# EAGLE design circuit (EAGLE 6.6.0)
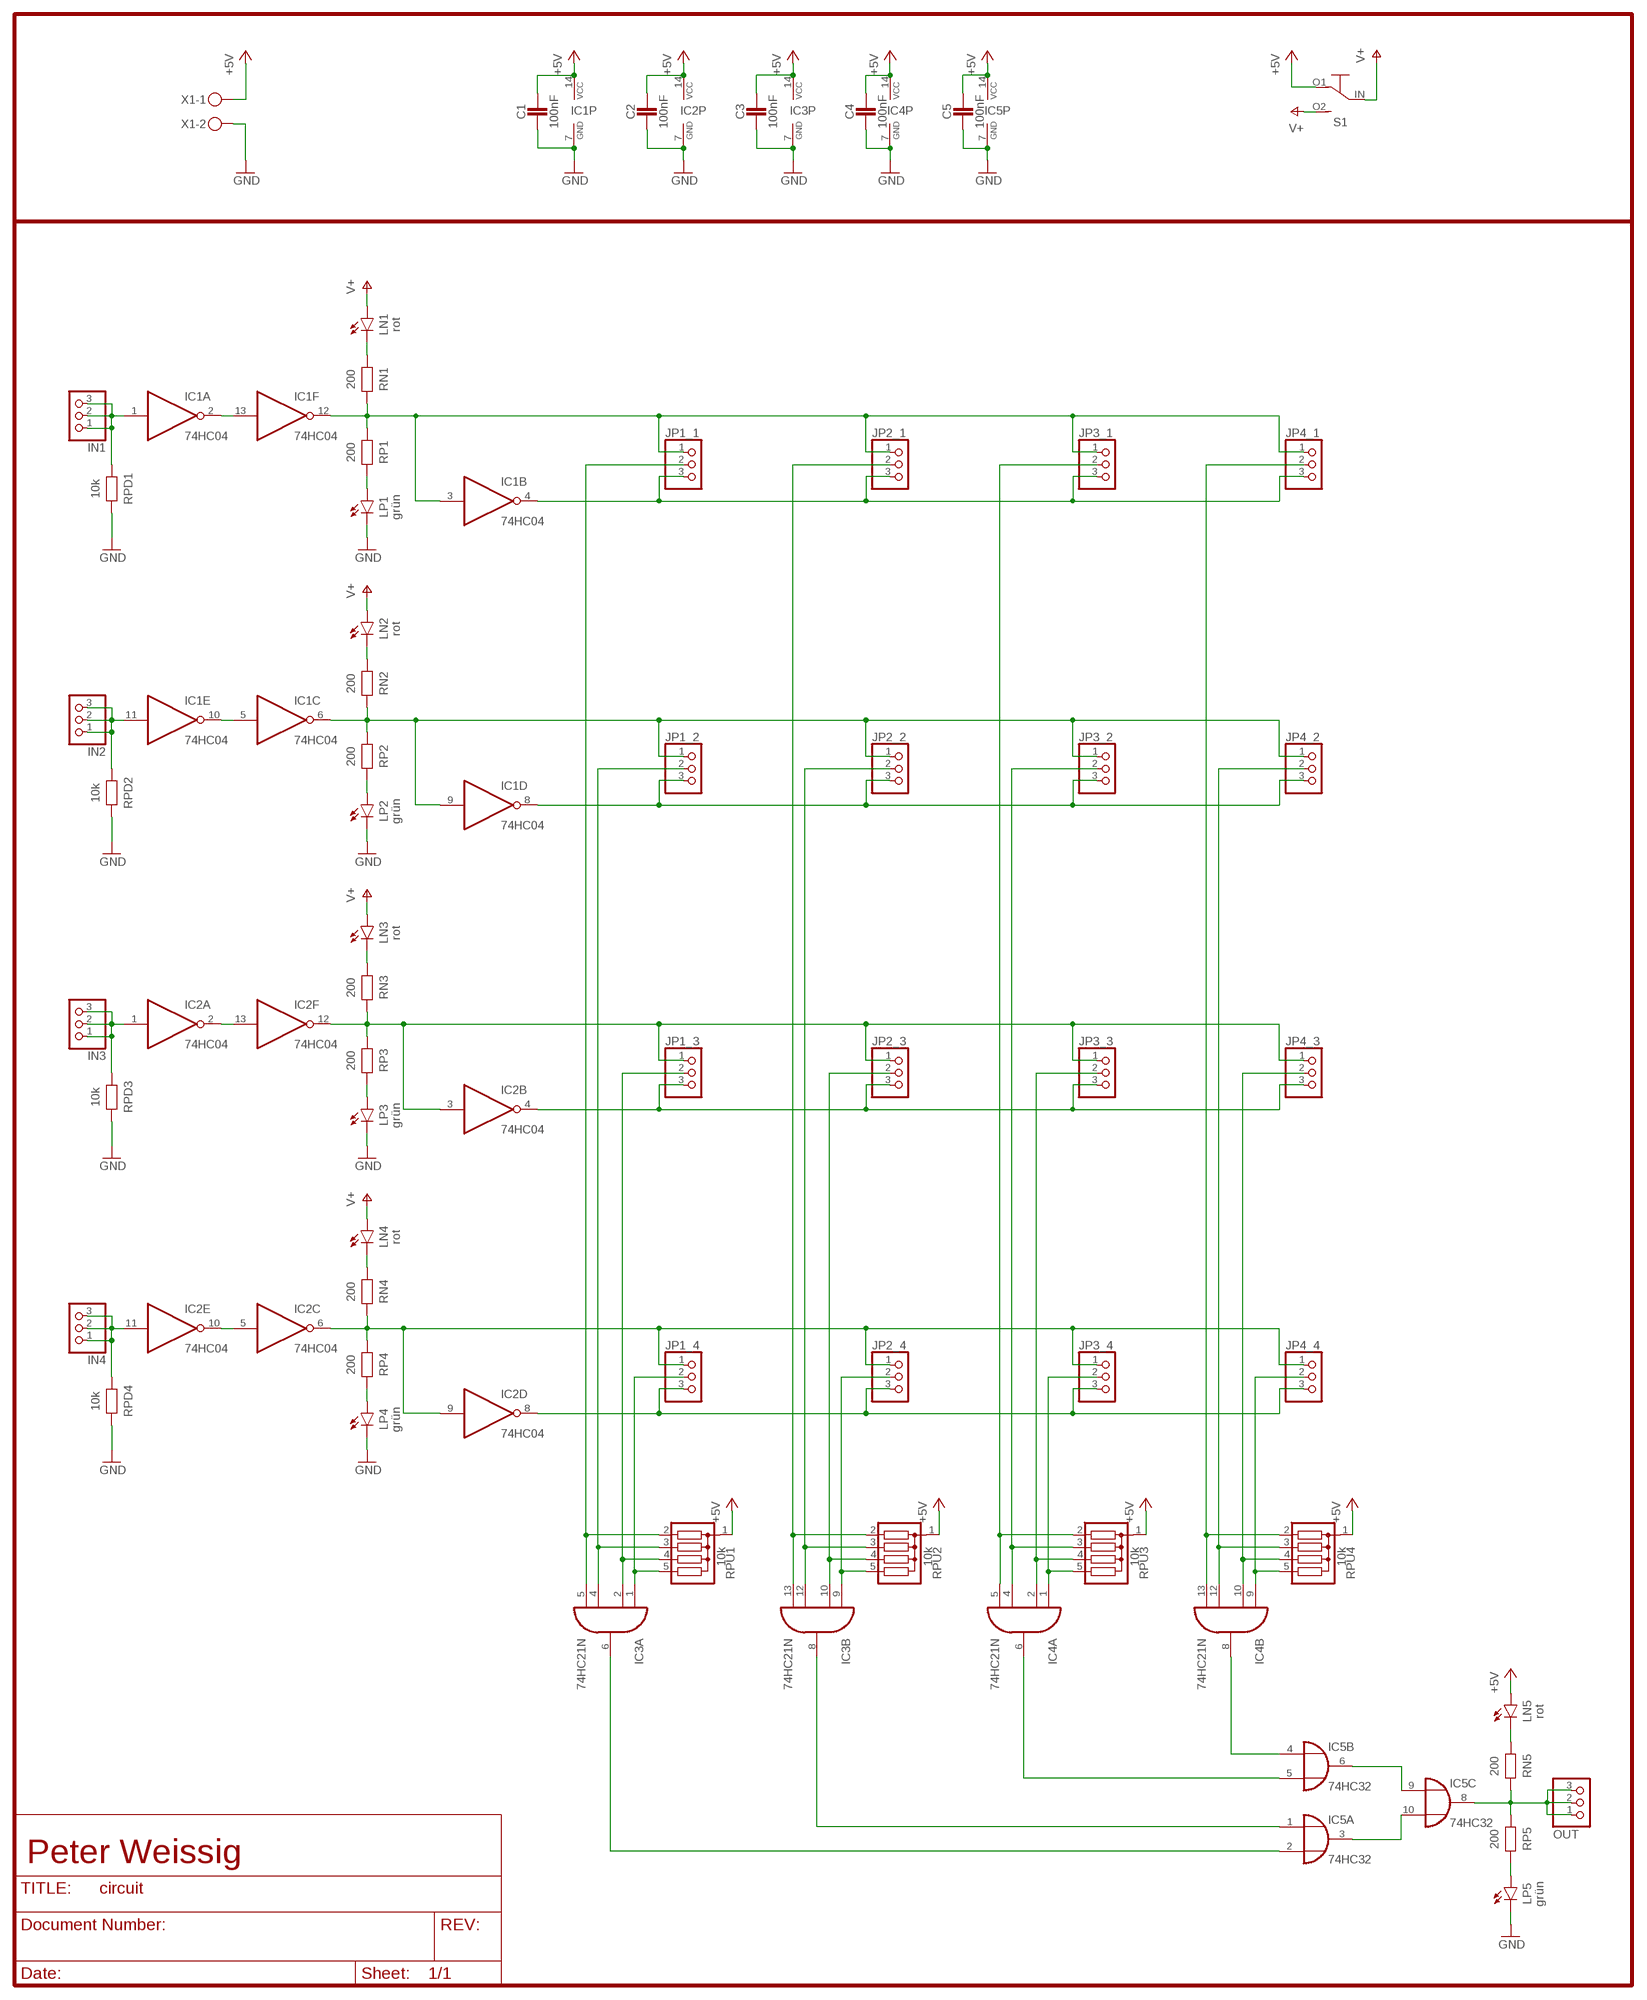
[diagram p0: schematic, sheet 1]

## Parts
C1  100nF  CAPACITATOR-2,5MM  [C_THT_2]
C2  100nF  CAPACITATOR-2,5MM  [C_THT_2]
C3  100nF  CAPACITATOR-5MM  [C_THT_3]
C4  100nF  CAPACITATOR-5MM  [C_THT_3]
C5  100nF  CAPACITATOR-2,5MM  [C_THT_2]
IC1  74HC04  74AC04N  [DIL14]
IC2  74HC04  74AC04N  [DIL14]
IC3  74HC21N  [DIL14]
IC4  74HC21N  [DIL14]
IC5  74HC32  74AC32N  [DIL14]
IN1  PINHD-1X3  [1X03]
IN2  PINHD-1X3  [1X03]
IN3  PINHD-1X3  [1X03]
IN4  PINHD-1X3  [1X03]
JP1_1  PINHD-1X3  [1X03]
JP1_2  PINHD-1X3  [1X03]
JP1_3  PINHD-1X3  [1X03]
JP1_4  PINHD-1X3  [1X03]
JP2_1  PINHD-1X3  [1X03]
JP2_2  PINHD-1X3  [1X03]
JP2_3  PINHD-1X3  [1X03]
JP2_4  PINHD-1X3  [1X03]
JP3_1  PINHD-1X3  [1X03]
JP3_2  PINHD-1X3  [1X03]
JP3_3  PINHD-1X3  [1X03]
JP3_4  PINHD-1X3  [1X03]
JP4_1  PINHD-1X3  [1X03]
JP4_2  PINHD-1X3  [1X03]
JP4_3  PINHD-1X3  [1X03]
JP4_4  PINHD-1X3  [1X03]
LN1  rot  LED-3MM  [LED_3MM]
LN2  rot  LED-3MM  [LED_3MM]
LN3  rot  LED-3MM  [LED_3MM]
LN4  rot  LED-3MM  [LED_3MM]
LN5  rot  LED-3MM  [LED_3MM]
LP1  grün  LED-3MM  [LED_3MM]
LP2  grün  LED-3MM  [LED_3MM]
LP3  grün  LED-3MM  [LED_3MM]
LP4  grün  LED-3MM  [LED_3MM]
LP5  grün  LED-3MM  [LED_3MM]
OUT  PINHD-1X3  [1X03]
RN1  200  RESISTOR-10MM  [R_THT_4]
RN2  200  RESISTOR-10MM  [R_THT_4]
RN3  200  RESISTOR-10MM  [R_THT_4]
RN4  200  RESISTOR-10MM  [R_THT_4]
RN5  200  RESISTOR-10MM  [R_THT_4]
RP1  200  RESISTOR-10MM  [R_THT_4]
RP2  200  RESISTOR-10MM  [R_THT_4]
RP3  200  RESISTOR-10MM  [R_THT_4]
RP4  200  RESISTOR-10MM  [R_THT_4]
RP5  200  RESISTOR-10MM  [R_THT_4]
RPD1  10k  RESISTOR-10MM  [R_THT_4]
RPD2  10k  RESISTOR-10MM  [R_THT_4]
RPD3  10k  RESISTOR-10MM  [R_THT_4]
RPD4  10k  RESISTOR-10MM  [R_THT_4]
RPU1  10k  G04R  [SIL5]
RPU2  10k  G04R  [SIL5]
RPU3  10k  G04R  [SIL5]
RPU4  10k  G04R  [SIL5]
S1  SCHALTER_UM-KIPP  [SCHALTER_KIPP_UM]
X1  STECKER_SPG_2  [STECKER_SPG_2]

## Nets
+5V: C1.1 C2.1 C3.1 C4.1 C5.1 IC1.14(P:VCC) IC2.14(P:VCC) IC3.14(P:VCC) IC4.14(P:VCC) IC5.14(P:VCC) LN5.A RPU1.1 RPU2.1 RPU3.1 RPU4.1 S1.O1 X1.1
GND: C1.2 C2.2 C3.2 C4.2 C5.2 IC1.7(P:GND) IC2.7(P:GND) IC3.7(P:GND) IC4.7(P:GND) IC5.7(P:GND) LP1.K(C) LP2.K(C) LP3.K(C) LP4.K(C) LP5.K(C) RPD1.1 RPD2.1 RPD3.1 RPD4.1 X1.2
N$1: IC3.5(A:I3) JP1_1.2 RPU1.2
N$2: LN1.K(C) RN1.2
N$3: IC3.13(B:I3) JP2_1.2 RPU2.2
N$4: LP2.A RP2.1
N$5: IC3.12(B:I2) JP2_2.2 RPU2.3
N$6: LN2.K(C) RN2.2
N$10: LP1.A RP1.1
N$12: LP3.A RP3.1
N$13: LN3.K(C) RN3.2
N$14: IC3.10(B:I1) JP2_3.2 RPU2.4
N$15: LP4.A RP4.1
N$16: LN4.K(C) RN4.2
N$17: IC1.1(A:I) IN1.1 IN1.2 IN1.3 RPD1.2
N$18: IC1.11(E:I) IN2.1 IN2.2 IN2.3 RPD2.2
N$19: IC3.9(B:I0) JP2_4.2 RPU2.5
N$20: IC4.5(A:I3) JP3_1.2 RPU3.2
N$21: IC4.4(A:I2) JP3_2.2 RPU3.3
N$22: IC2.11(E:I) IN4.1 IN4.2 IN4.3 RPD4.2
N$23: IC4.2(A:I1) JP3_3.2 RPU3.4
N$24: IC4.1(A:I0) JP3_4.2 RPU3.5
N$25: IC1.2(A:O) IC1.13(F:I)
N$26: IC1.5(C:I) IC1.10(E:O)
N$31: IC2.5(C:I) IC2.10(E:O)
N$32: IC2.2(A:O) IC2.13(F:I)
N$33: IC3.4(A:I2) JP1_2.2 RPU1.3
N$34: IC3.2(A:I1) JP1_3.2 RPU1.4
N$35: IC3.1(A:I0) JP1_4.2 RPU1.5
N$36: IC4.13(B:I3) JP4_1.2 RPU4.2
N$37: IC4.12(B:I2) JP4_2.2 RPU4.3
N$38: IC4.10(B:I1) JP4_3.2 RPU4.4
N$39: IC4.9(B:I0) JP4_4.2 RPU4.5
N$40: IC4.8(B:O) IC5.4(B:I0)
N$41: IC4.6(A:O) IC5.5(B:I1)
N$42: IC3.8(B:O) IC5.1(A:I0)
N$43: IC3.6(A:O) IC5.2(A:I1)
N$44: IC5.6(B:O) IC5.9(C:I0)
N$45: IC5.3(A:O) IC5.10(C:I1)
N$46: LP5.A RP5.1
N$47: LN5.K(C) RN5.2
N$50: IC2.1(A:I) IN3.1 IN3.2 IN3.3 RPD3.2
N_1N: IC1.4(B:O) JP1_1.3 JP2_1.3 JP3_1.3 JP4_1.3
N_1P: IC1.3(B:I) IC1.12(F:O) JP1_1.1 JP2_1.1 JP3_1.1 JP4_1.1 RN1.1 RP1.2
N_2N: IC1.8(D:O) JP1_2.3 JP2_2.3 JP3_2.3 JP4_2.3
N_2P: IC1.6(C:O) IC1.9(D:I) JP1_2.1 JP2_2.1 JP3_2.1 JP4_2.1 RN2.1 RP2.2
N_3N: IC2.4(B:O) JP1_3.3 JP2_3.3 JP3_3.3 JP4_3.3
N_3P: IC2.3(B:I) IC2.12(F:O) JP1_3.1 JP2_3.1 JP3_3.1 JP4_3.1 RN3.1 RP3.2
N_4N: IC2.8(D:O) JP1_4.3 JP2_4.3 JP3_4.3 JP4_4.3
N_4P: IC2.6(C:O) IC2.9(D:I) JP1_4.1 JP2_4.1 JP3_4.1 JP4_4.1 RN4.1 RP4.2
N_4P1: IC5.8(C:O) OUT.1 OUT.2 OUT.3 RN5.1 RP5.2
V+: LN1.A LN2.A LN3.A LN4.A S1.IN S1.O2
Unconnected: IC5.11(D:O) IC5.12(D:I0) IC5.13(D:I1)

## Notes on the sheet
- Peter Weissig

## Library data of the parts
C1-C5 = robo_ag:CAPACITATOR: Kondensator
IC1 IC2 = 74xx-eu:74*04: Hex INVERTER
IC3 IC4 = 74xx-eu:74*21: Dual 4-input AND gate
IC5 = 74xx-eu:74*32: Quad 2-input OR gate
IN1-IN4 JP1_1-JP1_4 JP2_1-JP2_4 JP3_1-JP3_4 JP4_1-JP4_4 OUT = pinhead:PINHD-1X3: PIN HEADER
LN1-LN5 LP1-LP5 = robo_ag:LED: Led Reichelt: LA E67B Variante: PLCC4 560-1400mcd 2,2V; 50mA Gelb-Orange SMD Reichelt: LA E67F Variante: PLCC4_REV 560mcd 2,65V; 50mA Orange SMD
RN1-RN5 RP1-RP5 RPD1-RPD4 = robo_ag:RESISTOR: Widerstand Reichelt: METALL x,xx[k]
RPU1-RPU4 = resistor-sil:G04R: SIL RESISTOR; OC_FARNELL: unknown; OC_NEWARK: unknown
S1 = robo_ag:SCHALTER_UM: Umschalter Reichelt: KIPP 1A11 Variante: KIPP Kippschalter mit Lötösen 5A bei 120V Reichelt: SS SMD402 Variante: SMD 24V 0,2A
X1 = robo_ag:STECKER_SPG_2: Anschlussklemme Reichelt:AKL 101-02 Nicht Anreihbar Reichelt:AKL 057-02 Anreihbar

## Board
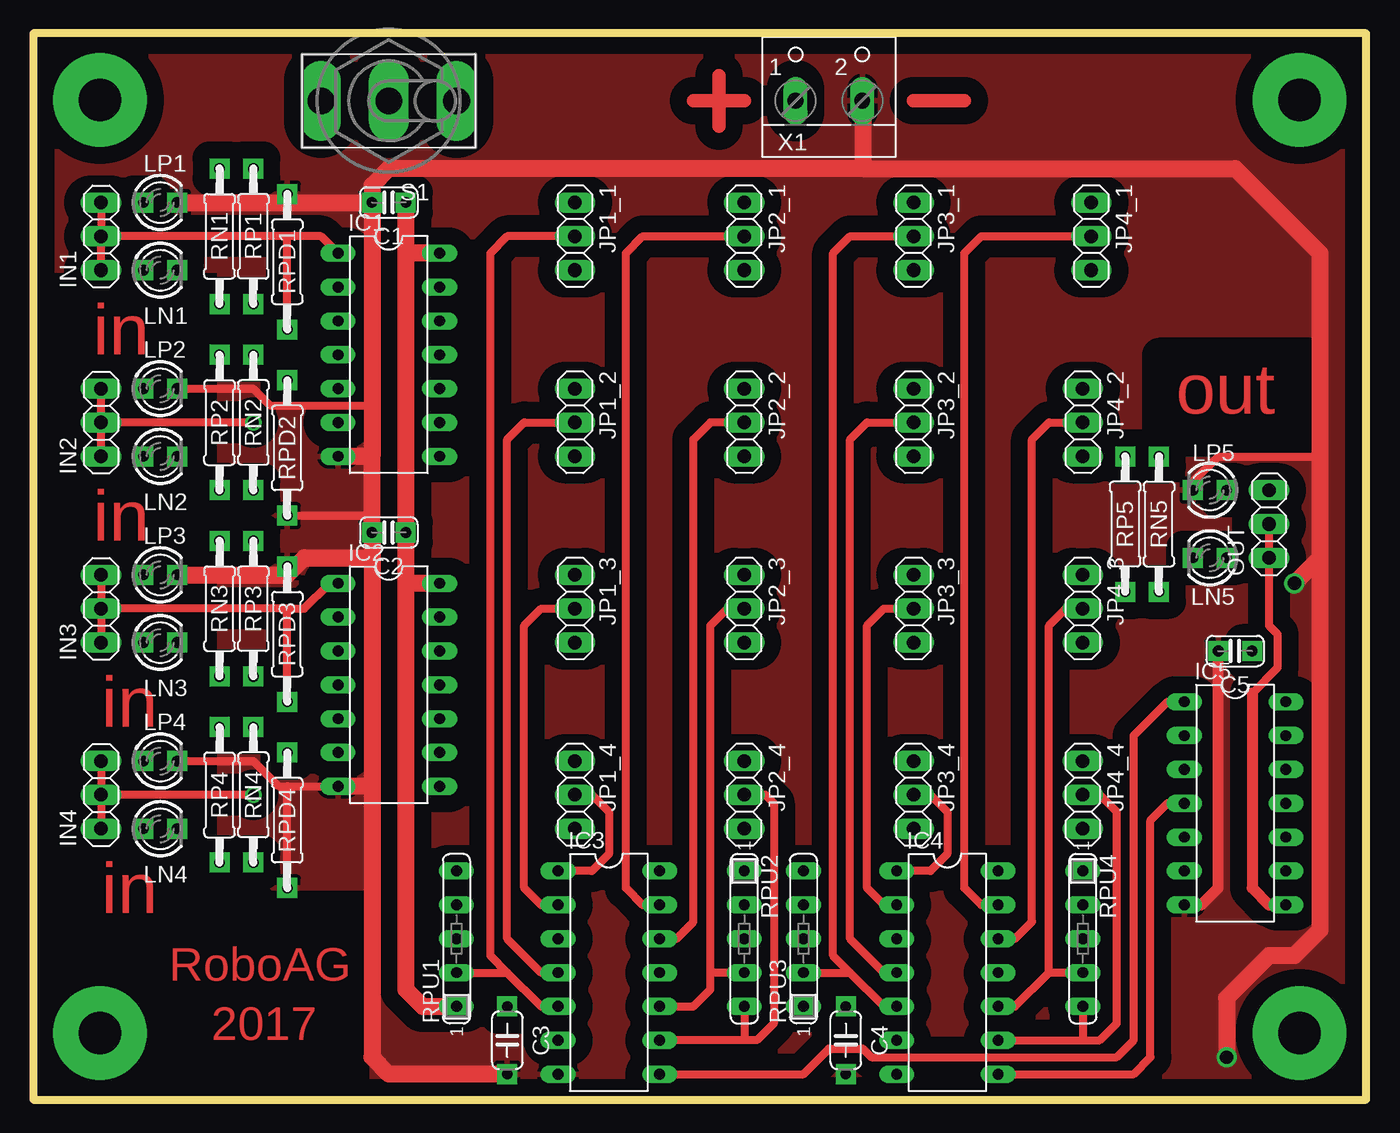
[diagram p1: board, top side]
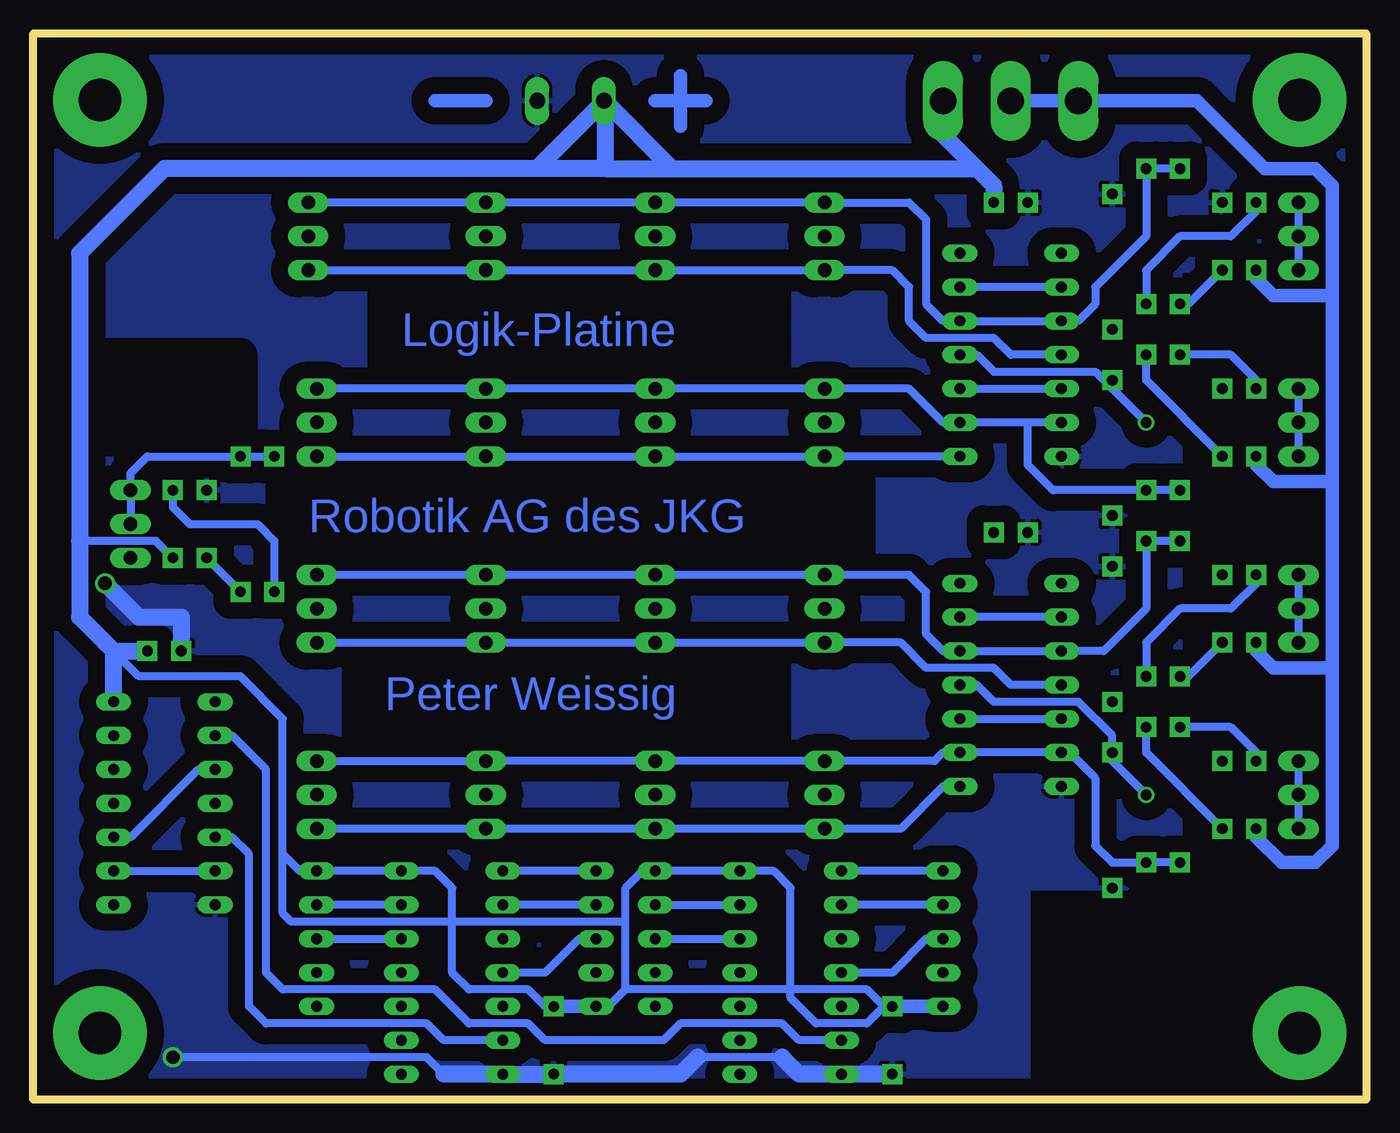
[diagram p2: board, bottom side, seen from below]

Size 100 x 80 mm. Coordinates in mm from the lower left corner, seen from the top.
Outline: 0,0 100,0 100,80 0,80 0,0
Copper layers (1*16): Top 0.035mm / dielectric 1.5mm / Bottom 0.035mm
Design rules "default": minimum track width 10mil, minimum drill 24mil, track to track 8mil, track to pad 8mil, pad to pad 8mil, via to via 8mil, smd to smd 8mil, copper to edge 40mil, drill to drill 8mil, minimum pad ring 10mil, minimum via ring 8mil, stop-mask expansion 4mil, vias tented up to drill 0mil, thermal gap 10mil
tRestrict: area 84.5,49.5 to 95.9,55.9
bRestrict: area 44.5,54.6 to 73.7,61; area 38.1,40.6 to 81.3,47; area 44.5,26.7 to 75.6,33; area 84.5,49.5 to 95.9,55.9

### Footprints (pad centres in the part's own frame; a part is rotated, then mirrored left to right if it is on the bottom)
C_THT_2 = drill 0.8 pad 1.5 square: 1 -1.27,0; 2 1.27,0
C_THT_3 = drill 0.8 pad 1.5 square: 1 -2.54,0; 2 2.54,0
DIL14 = drill 0.813 long: 1 -7.62,-3.81; 2 -5.08,-3.81; 3 -2.54,-3.81; 4 0,-3.81; 5 2.54,-3.81; 6 5.08,-3.81; 7 7.62,-3.81; 8 7.62,3.81; 9 5.08,3.81; 10 2.54,3.81; 11 0,3.81; 12 -2.54,3.81; 13 -5.08,3.81; 14 -7.62,3.81
1X03 = drill 1.016 long: 1 -2.54,0; 2 0,0; 3 2.54,0
LED_3MM = drill 0.8 pad 1.5 square: A -1.27,0; K 1.27,0
R_THT_4 = drill 0.8 pad 1.5 square: 1 -5.08,0; 2 5.08,0
SIL5 = drill 0.813 long: 1 -5.08,0; 2 -2.54,0; 3 0,0; 4 2.54,0; 5 5.08,0
SCHALTER_KIPP_UM = drill 2 pad 3 long: IN 0,0; O1 -5.08,0; O2 5.08,0
STECKER_SPG_2 = drill 1.194 long: 1 -2.5,-1.27; 2 2.5,-1.27

### Placement (x,y rotation side)
C1  26.67,67.31 180 top
C2  26.67,42.55 180 top
C3  35.56,4.45 270 top
C4  60.96,4.45 270 top
C5  90.17,33.66 180 top
IC1  26.67,55.88 270 top
IC2  26.67,31.11 270 top
IC3  43.18,9.53 270 top
IC4  68.58,9.53 270 top
IC5  90.17,22.23 270 top
IN1  5.08,64.77 90 top
IN2  5.08,50.8 90 top
IN3  5.08,36.83 90 top
IN4  5.08,22.86 90 top
JP1_1  40.64,64.77 270 top
JP1_2  40.64,50.8 270 top
JP1_3  40.64,36.83 270 top
JP1_4  40.64,22.86 270 top
JP2_1  53.34,64.77 270 top
JP2_2  53.34,50.8 270 top
JP2_3  53.34,36.83 270 top
JP2_4  53.34,22.86 270 top
JP3_1  66.04,64.77 270 top
JP3_2  66.04,50.8 270 top
JP3_3  66.04,36.83 270 top
JP3_4  66.04,22.86 270 top
JP4_1  79.38,64.77 270 top
JP4_2  78.74,50.8 270 top
JP4_3  78.74,36.83 270 top
JP4_4  78.74,22.86 270 top
LN1  9.53,62.23 0 top
LN2  9.53,48.26 0 top
LN3  9.53,34.29 0 top
LN4  9.53,20.32 0 top
LN5  88.27,40.64 180 top
LP1  9.53,67.31 0 top
LP2  9.53,53.34 0 top
LP3  9.53,39.37 0 top
LP4  9.53,25.4 0 top
LP5  88.27,45.72 180 top
OUT  92.71,43.18 90 top
RN1  13.97,64.77 270 top
RN2  16.51,50.8 90 top
RN3  13.97,36.83 270 top
RN4  16.51,22.86 90 top
RN5  84.45,43.18 270 top
RP1  16.51,64.77 90 top
RP2  13.97,50.8 270 top
RP3  16.51,36.83 90 top
RP4  13.97,22.86 270 top
RP5  81.92,43.18 90 top
RPD1  19.05,62.87 270 top
RPD2  19.05,48.9 90 top
RPD3  19.05,34.92 270 top
RPD4  19.05,20.95 90 top
RPU1  31.75,12.06 90 top
RPU2  53.34,12.06 270 top
RPU3  57.78,12.06 90 top
RPU4  78.74,12.06 270 top
S1  26.67,74.93 180 top
X1  59.69,76.2 0 top

### Tracks (layer width: path | path; a pad name or v marks a point on that pad's centre or on a via)
+5V
  Top 1.27: C1.1 27.94,63.5 | 27.94,63.5 C2.1 27.94,38.73 | 27.94,38.73 27.94,8.26 29.21,6.99 RPU1.1 | IC2.14 27.94,38.73 | IC1.14 27.94,63.5
  Bottom 0.61: 55.56,8.26 55.56,15.88 54.29,17.14 RPU2.1 IC3.14 44.45,17.14 43.18,15.88 43.18,8.26 | 55.56,8.26 56.83,6.99 RPU3.1 | 36.2,6.99 37.47,8.26 43.18,8.26 | 43.18,8.26 55.56,8.26 | C4.1 61.59,6.99 62.87,8.26 67.31,8.26 68.58,9.53 68.58,13.34 | 68.58,13.34 68.58,15.88 69.85,17.14 IC4.14 RPU4.1 80.01,17.14 81.28,18.41 | LN5.A 90.81,41.91 96.52,41.91 | 81.28,18.41 81.28,28.57 84.45,31.75 92.08,31.75 94.61,34.29 | C3.1 36.2,6.99 | 36.2,6.99 37.47,5.71 41.27,5.71 43.18,7.62 43.18,8.26 | 55.88,13.34 68.58,13.34 | 68.58,13.34 80.64,13.34 81.28,13.97 81.28,18.41
  Bottom 1.016: RPU1.1 C3.1 | RPU3.1 C4.1
  Bottom 1.27: X1.1 57.15,74.89 | 57.15,74.89 57.15,73.66 | 57.15,74.89 57.11,74.93 57.11,69.85 52.07,69.85 | S1.O1 31.75,72.39 29.21,69.85 | 29.21,69.85 27.94,68.58 C1.1 | 62.23,69.85 57.15,74.93 52.07,69.85 | 62.23,69.85 90.17,69.85 96.52,63.5 96.52,41.91 96.52,36.2 94.61,34.29 93.98,33.66 | 93.98,33.66 C5.1 | IC5.14 93.98,33.66 | 52.07,69.85 29.21,69.85 | 57.15,69.85 62.23,69.85
GND  (via drill 1)
  Top 0.61: LP2.K 16.51,53.34 17.78,52.07 25.4,52.07 | RPD3.1 19.05,39.37 | RPD2.1 25.4,43.81 | LP4.K 16.51,25.4 18.41,23.5 19.05,23.5 | 19.05,23.5 IC2.7 | RPD4.1 19.05,23.5 | LP5.K 87,46.35 88.9,48.26 96.52,48.26
  Top 0.813: IC5.7 87.63,14.61 88.9,15.88 C5.2
  Top 1.27: 25.4,48.26 25.4,52.07 C1.2 | 25.4,48.26 IC1.7 | LP1.K 19.05,67.31 | 19.05,67.31 C1.2 | 25.4,48.26 25.4,43.81 C2.2 25.4,40.64 | 25.4,40.64 25.4,23.5 | 25.4,23.5 IC2.7 | LP3.K 19.05,39.37 20.32,40.64 25.4,40.64 | X1.2 62.23,74.89 62.23,69.85 | 62.23,69.85 26.67,69.85 25.4,68.58 C1.2 | 25.4,23.5 25.4,3.17 26.67,1.91 C3.2 | RPD1.1 19.05,67.31 | 62.23,69.85 90.17,69.85 96.52,63.5 96.52,48.26 96.52,40.64 | 96.52,40.64 v94.61,38.73 | 96.52,40.64 96.52,12.7 94.61,10.79 92.71,10.79 89.53,7.62 v89.53,3.17
  Bottom 0.61: 43.81,3.17 50.16,3.17 | 69.22,1.91 70.48,3.17 v89.53,3.17
  Bottom 1.016: X1.2 62.23,74.93
  Bottom 1.27: C3.2 IC3.7 42.55,1.91 43.81,3.17 | 50.16,3.17 51.44,1.91 C4.2 IC4.7 69.22,1.91 | v94.61,38.73 92.08,36.2 88.9,36.2 C5.2
  pour Bottom (isolate 1.27): 0,80.01 99.86,80.01 99.86,0 25.4,0 25.4,15.88 13.97,15.88 13.97,62.23 0,62.23
  pour Top (isolate 1.27): 100.33,80.01 0,80.01 0,62.23 13.97,62.23 13.97,15.88 25.4,15.88 25.4,0 100.33,0
N$1
  Top 0.61: IC3.5 38.1,6.99 35.56,9.53 | 35.56,9.53 34.29,10.79 34.29,63.5 35.56,64.77 JP1_1.2 | RPU1.2 35.56,9.53
N$2
  Bottom 0.61: LN1.K 13.34,59.69 RN1.2
N$3
  Top 0.61: JP2_1.2 45.72,64.77 44.45,63.5 44.45,15.88 45.72,14.61 IC3.13
  Bottom 0.61: RPU2.2 IC3.13
N$4
  Bottom 0.61: LP2.A 8.26,53.98 10.16,55.88 RP2.1
N$5
  Top 0.61: JP2_2.2 50.8,50.8 49.53,49.53 49.53,13.34 48.26,12.06 IC3.12
  Bottom 0.61: RPU2.3 IC3.12
N$6
  Bottom 0.61: LN2.K 16.51,53.98 RN2.2
N$7
  Bottom 1.016: 66.04,74.93 69.85,74.93
N$8
  Top 1.016: 66.04,74.93 69.85,74.93
N$9
  Top 1.016: 53.34,74.93 49.53,74.93
N$10
  Bottom 0.61: RP1.1 16.51,62.23 13.97,64.77 10.16,64.77 8.26,66.67 LP1.A
N$11
  Top 1.016: 51.44,73.03 51.44,76.83
N$12
  Bottom 0.61: LP3.A 8.26,38.73 10.16,36.83 13.97,36.83 16.51,34.29 RP3.1
N$13
  Bottom 0.61: LN3.K 13.34,31.75 RN3.2
N$14
  Top 0.61: IC3.10 49.53,6.99 50.8,8.26 50.8,9.53 | 50.8,9.53 50.8,35.56 52.07,36.83 JP2_3.2 | RPU2.4 50.8,9.53
N$15
  Bottom 0.61: LP4.A 8.26,26.04 10.16,27.94 RP4.1
N$16
  Bottom 0.61: LN4.K 16.51,26.04 RN4.2
N$17
  Top 0.61: IC1.1 21.59,64.77 19.05,64.77 | 19.05,64.77 IN1.2 | IN1.3 IN1.2 | IN1.1 IN1.2 | RPD1.2 19.05,64.77
  Bottom 0.61: IN1.3 IN1.2 IN1.1
N$18  (via drill 0.8)
  Top 0.61: v16.51,50.8 IN2.2 | IN2.2 IN2.3 | IN2.1 IN2.2
  Bottom 0.61: IC1.11 29.21,55.88 27.94,54.61 20.32,54.61 19.05,53.34 | 19.05,53.34 v16.51,50.8 | IN2.3 IN2.2 IN2.1 | RPD2.2 19.05,53.34
N$19
  Top 0.61: JP2_4.2 54.93,22.86 55.56,22.23 55.56,5.71 54.29,4.45 53.34,4.45 | 53.34,4.45 IC3.9 | RPU2.5 53.34,4.45
N$20
  Top 0.61: IC4.5 63.82,6.99 61.28,9.53 | 61.28,9.53 60.01,10.79 60.01,63.5 61.28,64.77 JP3_1.2 | RPU3.2 61.28,9.53
N$21
  Top 0.61: IC4.4 63.82,9.53 61.28,12.06 61.28,49.53 62.55,50.8 JP3_2.2
  Bottom 0.61: RPU3.3 59.05,12.06 61.59,9.53 IC4.4
N$22  (via drill 0.8)
  Top 0.61: v16.51,22.86 IN4.2 | IN4.3 IN4.1
  Bottom 0.61: IN4.3 IN4.2 IN4.1 | v16.51,22.86 19.05,25.4 RPD4.2 19.05,27.3 21.59,29.84 27.94,29.84 29.21,31.11 IC2.11
N$23
  Top 0.61: IC4.2 63.82,14.61 62.55,15.88 62.55,35.56 63.82,36.83 JP3_3.2
  Bottom 0.61: RPU3.4 IC4.2
N$24
  Top 0.61: JP3_4.2 67.31,22.86 68.58,21.59 68.58,18.41 67.31,17.14 IC4.1
  Bottom 0.61: RPU3.5 IC4.1
N$25
  Bottom 0.61: IC1.2 IC1.13
N$26
  Bottom 0.61: IC1.10 IC1.5
N$27  (via drill 3.2 pad 7)
  other vias: 5,5
N$28  (via drill 3.2 pad 7)
  other vias: 95,5
N$29  (via drill 3.2 pad 7)
  other vias: 95,75
N$30  (via drill 3.2 pad 7)
  other vias: 5,75
N$31
  Bottom 0.61: IC2.10 IC2.5
N$32
  Bottom 0.61: IC2.2 IC2.13
N$33
  Top 0.61: IC3.4 38.1,9.53 35.56,12.06 35.56,49.53 36.83,50.8 JP1_2.2
  Bottom 0.61: RPU1.3 33.02,12.06 35.56,9.53 IC3.4
N$34
  Top 0.61: IC3.2 38.1,14.61 36.83,15.88 36.83,35.56 38.1,36.83 JP1_3.2
  Bottom 0.61: RPU1.4 IC3.2
N$35
  Top 0.61: JP1_4.2 41.91,22.86 43.18,21.59 43.18,18.41 41.91,17.14 IC3.1
  Bottom 0.61: RPU1.5 IC3.1
N$36
  Top 0.61: IC4.13 71.12,14.61 69.85,15.88 69.85,63.5 71.12,64.77 JP4_1.2
  Bottom 0.61: IC4.13 RPU4.2
N$37
  Top 0.61: IC4.12 73.66,12.06 74.93,13.34 74.93,49.53 76.2,50.8 JP4_2.2
  Bottom 0.61: RPU4.3 IC4.12
N$38
  Top 0.61: IC4.10 73.66,6.99 76.2,9.53 | 76.2,9.53 76.2,35.56 77.47,36.83 JP4_3.2 | RPU4.4 76.2,9.53
N$39
  Top 0.61: JP4_4.2 80.01,22.86 81.28,21.59 81.28,5.71 80.01,4.45 78.74,4.45 | IC4.9 78.74,4.45 | RPU4.5 78.74,4.45
N$40
  Top 0.61: IC4.8 82.55,1.91 83.82,3.17 83.82,20.95 85.09,22.23 IC5.4
N$41
  Bottom 0.61: IC4.6 69.22,4.45 70.48,5.71 82.55,5.71 83.82,6.99 83.82,18.41 85.09,19.68 IC5.5
N$42
  Top 0.61: IC3.8 57.78,1.91 59.69,3.81 62.23,3.81 62.87,3.17 81.28,3.17 82.55,4.45 82.55,27.3 85.09,29.84 IC5.1
N$43
  Bottom 0.61: IC3.6 42.55,4.45 43.81,5.71 51.44,5.71 52.7,4.45 61.59,4.45 62.87,5.71 67.31,5.71 69.85,8.26 81.28,8.26 82.55,9.53 82.55,24.77 85.09,27.3 IC5.2
N$44
  Bottom 0.61: IC5.9 IC5.6
N$45
  Bottom 0.61: IC5.3 87.63,24.77 92.71,19.68 IC5.10
N$46
  Bottom 0.61: LP5.A 89.53,44.45 88.27,43.18 83.19,43.18 81.92,41.91 RP5.1
N$47
  Bottom 0.61: RN5.2 LN5.K
N$48
  Bottom 1.016: 51.44,76.83 51.44,74.93 | 51.44,74.93 51.44,73.03 | 51.44,74.93 53.34,74.93 | 51.44,74.93 49.53,74.93
N$50
  Top 0.61: RPD3.2 19.05,36.83 | 19.05,36.83 IN3.2 | 19.05,36.83 20.32,36.83 22.23,38.73 IC2.1 | IN3.3 IN3.1
  Bottom 0.61: IN3.3 IN3.2 IN3.1
N_1N
  Bottom 0.61: JP4_1.3 JP3_1.3 JP2_1.3 JP1_1.3 35.56,62.23 34.29,60.96 34.29,58.42 33.02,57.15 27.94,57.15 26.67,55.88 IC1.4
N_1P
  Bottom 0.61: RN1.1 RP1.2 16.51,64.77 20.32,60.96 20.32,59.69 21.59,58.42 IC1.3 IC1.12 31.75,58.42 33.02,59.69 33.02,66.04 34.29,67.31 JP1_1.1 JP2_1.1 JP3_1.1 JP4_1.1
N_2N
  Bottom 0.61: JP4_2.3 JP3_2.3 JP2_2.3 JP1_2.3 IC1.8
N_2P
  Bottom 0.61: RP2.2 RN2.1 23.5,45.72 25.4,47.62 25.4,50.8 | IC1.6 25.4,50.8 | 25.4,50.8 IC1.9 31.75,50.8 34.29,53.34 JP1_2.1 JP2_2.1 | 53.98,53.34 JP2_2.1 | JP2_2.1 JP3_2.1 JP4_2.1
N_3N
  Bottom 0.61: JP4_3.3 JP3_3.3 JP2_3.3 JP1_3.3 34.92,34.29 33.02,32.38 27.94,32.38 26.67,31.11 IC2.4
N_3P
  Bottom 0.61: RN3.1 RP3.2 16.51,36.83 19.68,33.66 IC2.3 IC2.12 31.75,33.66 33.02,34.92 33.02,38.1 34.29,39.37 JP1_3.1 JP2_3.1 JP3_3.1 JP4_3.1
N_4N
  Bottom 0.61: IC2.8 31.75,23.5 34.92,20.32 JP1_4.3 JP2_4.3 | 53.98,20.32 JP2_4.3 | JP2_4.3 JP3_4.3 JP4_4.3
N_4P
  Bottom 0.61: RP4.2 RN4.1 19.05,17.78 20.32,19.05 20.32,24.13 22.23,26.04 IC2.6 IC2.9 31.75,26.04 32.38,25.4 JP1_4.1 | 41.27,25.4 JP1_4.1 | JP1_4.1 JP2_4.1 JP3_4.1 JP4_4.1
N_4P1
  Top 0.61: OUT.2 OUT.1 92.71,35.56 93.34,34.92 93.34,32.38 91.44,30.48
  Top 0.813: 91.44,30.48 91.44,15.88 92.71,14.61 IC5.8
  Bottom 0.61: OUT.2 OUT.3 92.71,46.99 91.44,48.26 RN5.1 RP5.2
V+
  Bottom 1.016: 2.54,60.33 2.54,46.35 | 2.54,46.35 2.54,32.38 | 2.54,32.38 2.54,19.05 3.81,17.78 6.35,17.78 8.26,19.68 LN4.A | LN3.A 8.26,33.66 6.99,32.38 2.54,32.38 | LN2.A 8.26,47.62 6.99,46.35 2.54,46.35 | LN1.A 8.26,61.59 6.99,60.33 2.54,60.33 | S1.IN S1.O2 12.7,74.93 7.62,69.85 3.81,69.85 2.54,68.58 2.54,60.33

### Text on the board
Top: in | out | in | in | in | RoboAG | 2017
Bottom: Logik-Platine | Robotik AG des JKG | Peter Weissig